# Altium project LED Controller.PrjPCB
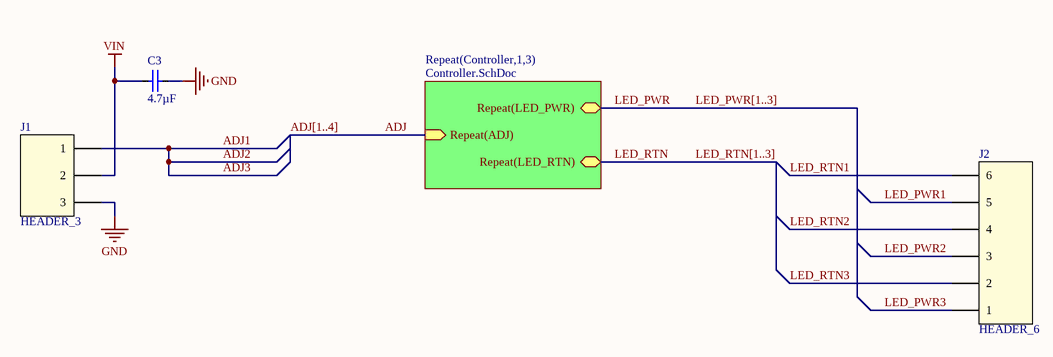
[diagram p0: Top Level.SchDoc]
2 sheets, 21 parts. Net scope: hierarchical (ports join the sheet entries above them; power ports are global).
Board file: LED Controller.PcbDoc
Sheets:
  Top Level.SchDoc
    Controller1 = Controller.SchDoc
    Controller2 = Controller.SchDoc
    Controller3 = Controller.SchDoc

## Sheet Top Level.SchDoc
size A

### Parts
C3  4.7µF  [CAP_1206]
J1  HEADER_3  [MOLEX_C-GRID3_3PIN]
J2  HEADER_6  [MOLEX_C-GRID3_6PIN]

### Sub-sheets
Repeat(Controller,1,3) = Controller.SchDoc: Repeat(ADJ) (in), Repeat(LED_PWR), Repeat(LED_RTN)

### Nets
GND: C3.2 J1.3
VIN: C3.1 J1.2
ADJ: sheet Repeat(Controller,1,3)/Repeat(ADJ)
ADJ1: J1.1  [also labelled ADJ2, ADJ3]
LED_PWR: sheet Repeat(Controller,1,3)/Repeat(LED_PWR)
LED_PWR1: J2.5
LED_PWR2: J2.3
LED_PWR3: J2.1
LED_RTN: sheet Repeat(Controller,1,3)/Repeat(LED_RTN)
LED_RTN1: J2.6
LED_RTN2: J2.4
LED_RTN3: J2.2

### Buses and harness runs
bus ADJ[1..4]
bus LED_PWR[1..3]
bus LED_RTN[1..3]

### Library data of the parts
C3 = CAPACITOR: Manufacturer: TDK Corporation; Manufacturer Part Number: C3216X7R1V475M160AE; Temperature Coefficient: X7R; Voltage - Rated: 35V; Capacitance: 4.7µF; Package / Case: 1206 (3216 Metric); Supplier 1: Digi-Key; Supplier Part Number 1: 445-6813-2-ND; Applications: Boardflex Sensitive; Operating Temperature: -55°C ~ 125°C
J1 = HEADER_3: Supplier 1: Digi-Key; Supplier Part Number 1: WM8204-ND
J2 = HEADER_6: Supplier 1: Digi-Key; Supplier Part Number 1: WM8197-ND

## Sheet Controller.SchDoc
size A
Used 3 times, as channels Controller1, Controller2, Controller3. Parts and nets are listed once, with the designators drawn on the sheet.
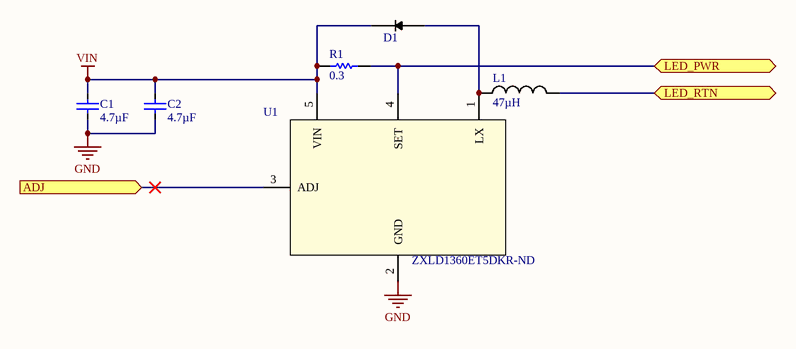
[diagram p1: Controller.SchDoc]

### Parts
C1  4.7µF  [CAP_1206]
C2  4.7µF  [CAP_1206]
D1  DIODE  [DO-214AA(SMB)]  (value not drawn)
L1  47µH  [INDUCTOR_BOURNS_SRN8040]
R1  0.3  [RES_0805]
U1  Supplier Part Number 1: ZXLD1360ET5DKR-ND  [SOT95P245X110-5N]  (hidden comment: ZXLD1360)

### Ports
ADJ (in), LED_PWR, LED_RTN

### Nets
GND: C1.2 C2.2 U1.2(GND)
VIN: C1.1 C2.1 D1.1(A) R1.1 U1.5(VIN)
ADJ: U1.3(ADJ) ; port ADJ
LED_PWR: R1.2 U1.4(SET) ; port LED_PWR
LED_RTN: L1.2 ; port LED_RTN
NetD1_2: D1.2(K) L1.1 U1.1(LX)

### Channels
Controller1: designators end in _Controller1; ports ADJ=ADJ1 LED_PWR=LED_PWR1 LED_RTN=LED_RTN1
Controller2: designators end in _Controller2; ports ADJ=ADJ1 LED_PWR=LED_PWR2 LED_RTN=LED_RTN2
Controller3: designators end in _Controller3; ports ADJ=ADJ1 LED_PWR=LED_PWR3 LED_RTN=LED_RTN3

### Library data of the parts
C1 C2 = CAPACITOR: as C3 on sheet Top Level; Capacitance: 4.7µF; Package / Case: 1206 (3216 Metric); Supplier 1: Digi-Key; Supplier Part Number 1: 445-6813-2-ND; Applications: Boardflex Sensitive; Operating Temperature: -55°C ~ 125°C
D1 = DIODE: Voltage - DC Reverse (Vr) (Max): 40V; Voltage - Forward (Vf) (Max) @ If: 500mV @ 2A; Diode Type: Schottky; Current - Reverse Leakage @ Vr: 400µA @ 40V; Current - Average Rectified (Io): 2A; Description: DIODE SCHOTTKY 40V 2A SMB; Supplier 1: Digi-Key; Supplier Part Number 1: SS24T3GOSCT-ND; Operating Temperature - Junction: -55°C ~ 150°C
L1 = INDUCTOR: Manufacturer: Bourns Inc.; Manufacturer Part Number: SRN8040-470M; Tolerance: ±20%; DC Resistance (DCR): 190 mOhm Max; Current - Saturation: 1.5A; Frequency - Test: 100kHz; Current Rating: 1.4A; Inductance: 47µH; Supplier 1: Digi-Key; Supplier Part Number 1: SRN8040-470MDKR-ND; ComponentLink1URL: http://www.bourns.com/data/global/pdfs/SRN8040.pdf; ComponentLink1Description: http://www.bourns.com/data/global/pdfs/SRN8040.pdf
R1 = RESISTOR: Manufacturer Part Number: RLP73N2AR30JTD; Manufacturer: TE Connectivity; Power (Watts): 0.25W, 1/4W; Tolerance: ±5%; Temperature Coefficient: ±300ppm/°C; Supplier 1: Digi-Key; Supplier Part Number 1: A109804DKR-ND; Resistance: 0.3
U1 = ZXLD1360: Supplier 1: Digi-Key

## Nets that join several sheets
GND: Top Level (C3.2 J1.3), Controller1 (C1_Controller1.2 C2_Controller1.2 U1_Controller1.2), Controller2 (C1_Controller2.2 C2_Controller2.2 U1_Controller2.2), Controller3 (C1_Controller3.2 C2_Controller3.2 U1_Controller3.2)
VIN: Top Level (C3.1 J1.2), Controller1 (5 pins), Controller2 (5 pins), Controller3 (5 pins)
ADJ1: Top Level (J1.1), Controller1 (U1_Controller1.3), Controller2 (U1_Controller2.3), Controller3 (U1_Controller3.3)
LED_PWR1: Top Level (J2.5), Controller1 (R1_Controller1.2 U1_Controller1.4)
LED_PWR2: Top Level (J2.3), Controller2 (R1_Controller2.2 U1_Controller2.4)
LED_PWR3: Top Level (J2.1), Controller3 (R1_Controller3.2 U1_Controller3.4)
LED_RTN1: Top Level (J2.6), Controller1 (L1_Controller1.2)
LED_RTN2: Top Level (J2.4), Controller2 (L1_Controller2.2)
LED_RTN3: Top Level (J2.2), Controller3 (L1_Controller3.2)